# EAGLE design Pyro_Cut-Down (EAGLE 9.1.3)
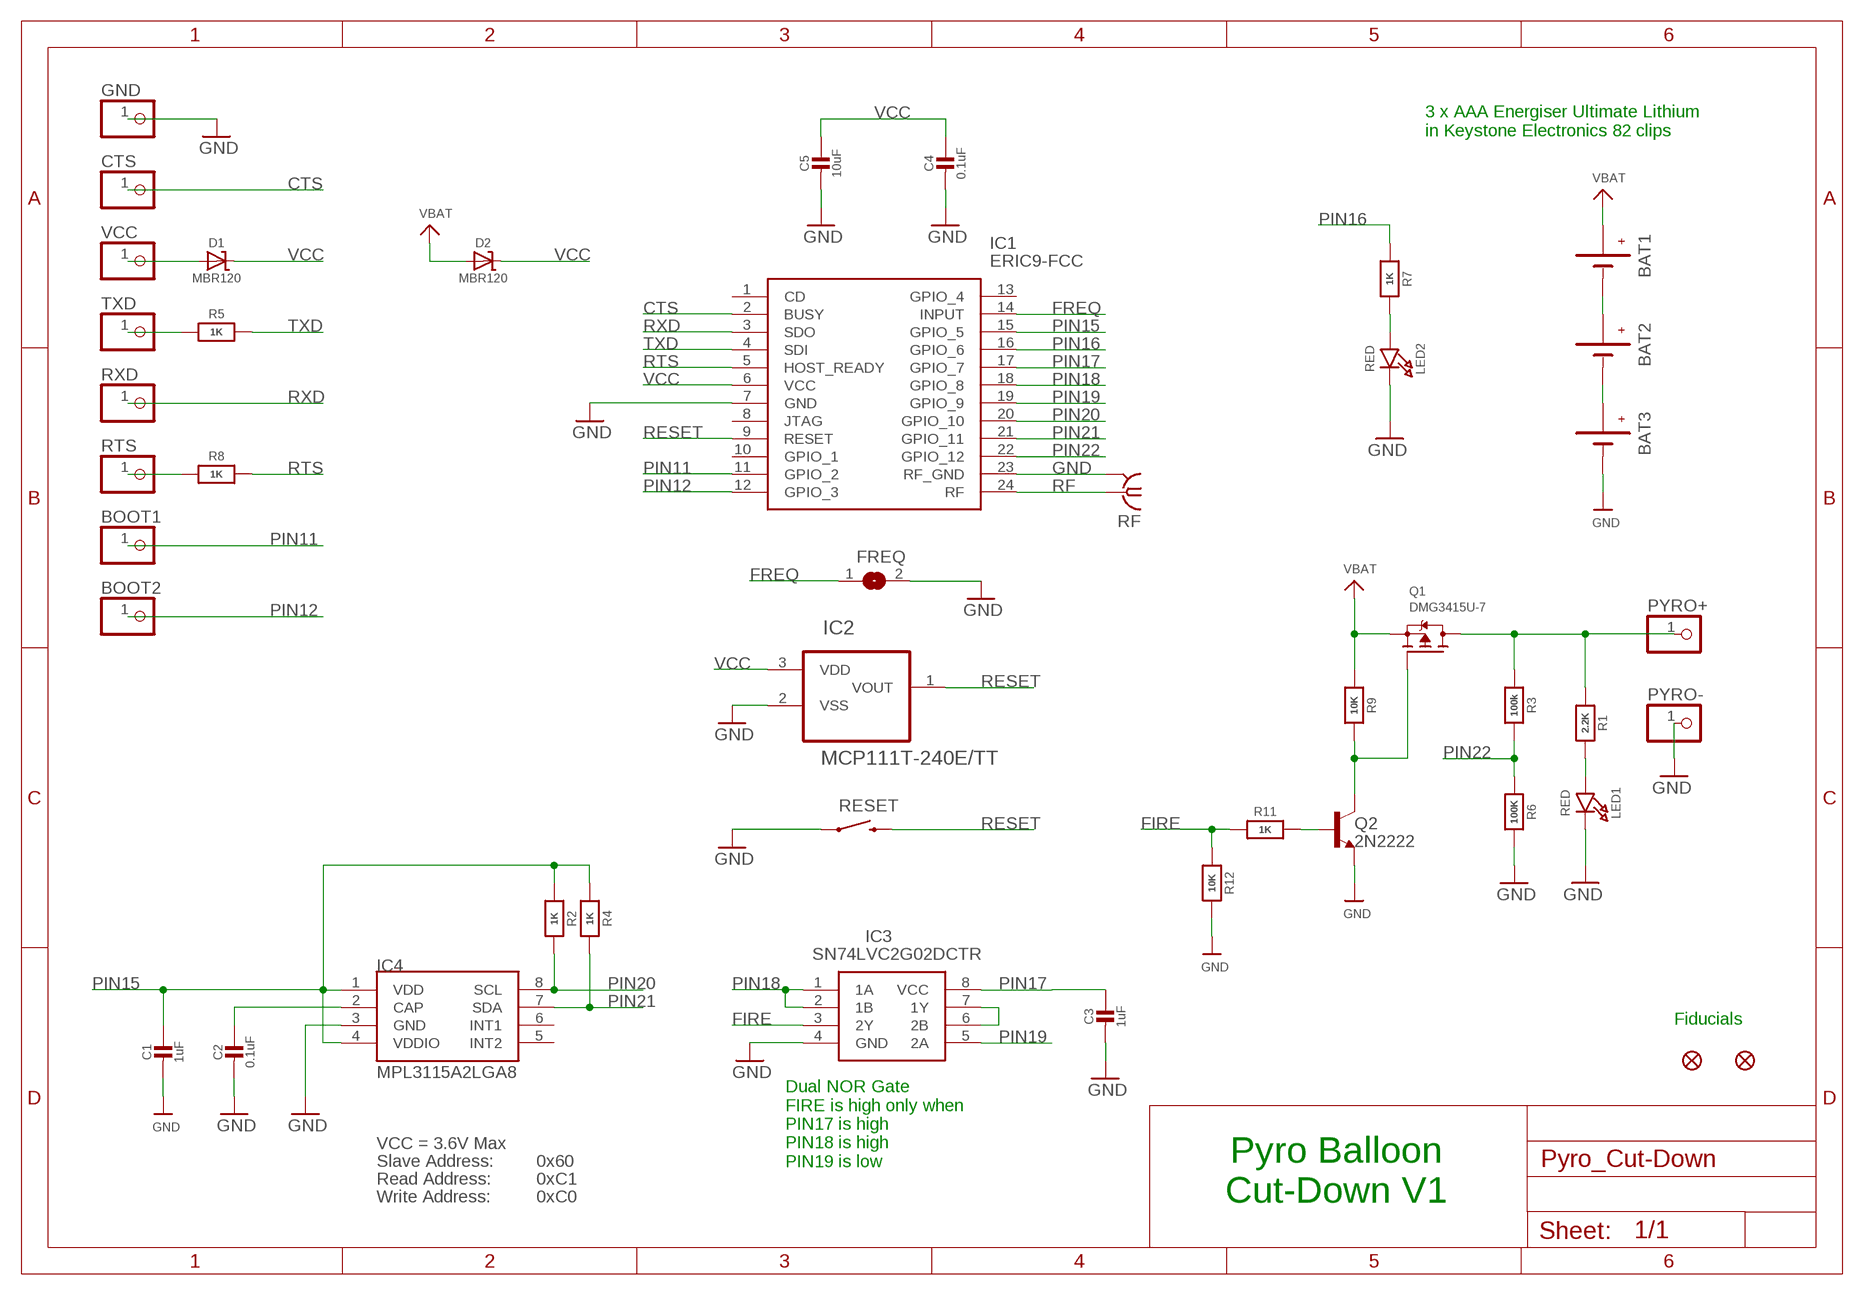
[diagram p0: schematic, sheet 1]

## Parts
BAT1  BATTERYKEYSTONE82  [BATTERY-AAA-KEYSTONE82]
BAT2  BATTERYKEYSTONE82  [BATTERY-AAA-KEYSTONE82]
BAT3  BATTERYKEYSTONE82  [BATTERY-AAA-KEYSTONE82]
BOOT1  PINHD-1X1  [1X01]
BOOT2  PINHD-1X1  [1X01]
C1  1uF  CAP_CERAMIC0603_NO  [0603-NO]
C2  0.1uF  CAP_CERAMIC0603_NO  [0603-NO]
C3  1uF  CAP_CERAMIC0603_NO  [0603-NO]
C4  0.1uF  CAP_CERAMIC0603_NO  [0603-NO]
C5  10uF  CAP_CERAMIC0805-NOOUTLINE  [0805-NO]
CTS  PINHD-1X1  [1X01]
D1  MBR120  DIODE-SCHOTTKYSOD-123  [SOD-123]
D2  MBR120  DIODE-SCHOTTKYSOD-123  [SOD-123]
FD1  FIDUCIAL1X2  [FIDUCIAL-1X2]
FD2  FIDUCIAL1X2  [FIDUCIAL-1X2]
FREQ  SOLDERJUMPER  [SOLDERJUMPER_ARROW_NOPASTE]
GND  PINHD-1X1  [1X01]
IC1  ERIC9-FCC  [ERIC4]
IC2  MCP111T-240E/TT  MCP111T-270E/TT  [SOT95P237X112-3N]
IC3  SN74LVC2G02DCTR  [SOP65P400X130-8N]
IC4  MPL3115A2LGA8  [LGA8]
LED1  RED  LED0805_NOOUTLINE  [CHIPLED_0805_NOOUTLINE]
LED2  RED  LED0805_NOOUTLINE  [CHIPLED_0805_NOOUTLINE]
PYRO+  PINHD-1X1  [1X01]
PYRO-  PINHD-1X1  [1X01]
Q1  DMG3415U-7  MOSFET-PWIDE  [SOT23-WIDE]
Q2  2N2222  MMBT2222ALT1-NPN-SOT23-BEC  [SOT23-BEC]
R1  2.2K  RESISTOR_0603_NOOUT  [0603-NO]
R2  1K  RESISTOR_0603_NOOUT  [0603-NO]
R3  100k  RESISTOR_0603_NOOUT  [0603-NO]
R4  1K  RESISTOR_0603_NOOUT  [0603-NO]
R5  1K  RESISTOR_0603_NOOUT  [0603-NO]
R6  100K  RESISTOR_0603_NOOUT  [0603-NO]
R7  1K  RESISTOR_0603_NOOUT  [0603-NO]
R8  1K  RESISTOR_0603_NOOUT  [0603-NO]
R9  10K  RESISTOR_0603_NOOUT  [0603-NO]
R11  1K  RESISTOR_0603_NOOUT  [0603-NO]
R12  10K  RESISTOR_0603_NOOUT  [0603-NO]
RESET  SWITCH-MOMENTARY-2PTH  [TACTILE-PTH]
RF  SMA-142-0711-821/826  [J502-ND-142-0711-821/826]
RTS  PINHD-1X1  [1X01]
RXD  PINHD-1X1  [1X01]
TXD  PINHD-1X1  [1X01]
VCC  PINHD-1X1  [1X01]

## Nets
CTS: CTS.1 IC1.2(BUSY)
FIRE: IC3.3(2Y) R11.1 R12.1
FREQ: FREQ.1 IC1.14(INPUT)
GND: BAT3.GND@1(-) BAT3.GND@2(-) C1.2 C2.2 C3.2 C4.2 C5.2 FREQ.2 GND.1 IC1.7(GND) IC1.23(RF_GND) IC2.2(VSS) IC3.4(GND) IC4.3(GND) LED1.C LED2.C PYRO-.1 Q2.E R6.2 R12.2 RESET.1 RF.G@1 RF.G@2 RF.G@3 RF.G@4
N$1: BAT2.GND@1(-) BAT2.GND@2(-) BAT3.PWR@1(+) BAT3.PWR@2(+)
N$2: LED2.A R7.2
N$3: BAT1.GND@1(-) BAT1.GND@2(-) BAT2.PWR@1(+) BAT2.PWR@2(+)
N$4: LED1.A R1.2
N$5: R5.1 TXD.1
N$6: IC3.6(2B) IC3.7(1Y)
N$7: R8.1 RTS.1
N$9: D1.A VCC.1
N$19: Q1.1(G) Q2.C R9.2
N$20: Q2.B R11.2
N$25: C2.1 IC4.2(CAP)
PIN11: BOOT1.1 IC1.11(GPIO_2)
PIN12: BOOT2.1 IC1.12(GPIO_3)
PIN15: C1.1 IC1.15(GPIO_5) IC4.1(VDD) IC4.4(VDDIO) R2.1 R4.1
PIN16: IC1.16(GPIO_6) R7.1
PIN17: C3.1 IC1.17(GPIO_7) IC3.8(VCC)
PIN18: IC1.18(GPIO_8) IC3.1(1A) IC3.2(1B)
PIN19: IC1.19(GPIO_9) IC3.5(2A)
PIN20: IC1.20(GPIO_10) IC4.8(SCL) R2.2
PIN21: IC1.21(GPIO_11) IC4.7(SDA) R4.2
PIN22: IC1.22(GPIO_12) R3.2 R6.1
PYRO: PYRO+.1 Q1.3(D) R1.1 R3.1
RESET: IC1.9(RESET) IC2.1(VOUT) RESET.3
RF: IC1.24(RF) RF.1
RTS: IC1.5(HOST_READY) R8.2
RXD: IC1.3(SDO) RXD.1
TXD: IC1.4(SDI) R5.2
VBAT: BAT1.PWR@1(+) BAT1.PWR@2(+) D2.A Q1.2(S) R9.1
VCC: C4.1 C5.1 D1.C D2.C IC1.6(VCC) IC2.3(VDD)
Unconnected: IC1.1(CD) IC1.8(JTAG) IC1.10(GPIO_1) IC1.13(GPIO_4) IC4.5(INT2) IC4.6(INT1)

## Notes on the sheet
- 3 x AAA Energiser Ultimate Lithium
  in Keystone Electronics 82 clips
- Fiducials
- VCC = 3.6V Max
- Slave Address: | 0x60
- Dual NOR Gate
  FIRE is high only when
  PIN17 is high
  PIN18 is high
  PIN19 is low
- Read Address: | 0xC1
- Write Address: | 0xC0
- Pyro Balloon
  Cut-Down V1

## Library data of the parts
BAT1-BAT3 = SparkFun-Electromechanical:BATTERY: Battery Holders Various common sizes : AA, AAA, 18650 (PRT-12895), 20mm coin cell and 12mm coin cell. 20MM_4LEGS, BATT-10373
BOOT1 BOOT2 CTS GND PYRO+ PYRO- RTS RXD TXD VCC = adafruit:PINHD-1X1: Pin header 1x1 for 0.1" spacing With round pins
C1-C5 = microbuilder:CAP_CERAMIC: Ceramic Capacitors For new designs, use the packages preceded by an '_' character since they are more reliable: The following footprints should be used on most boards: _0402 - Standard footprint for regular board layouts _0603 - Standard footprint for regular board layouts _0805 - Standard footprint for regular board layouts _1206 - Standard footprint for regular board layouts For extremely tight-pitch boards where space is at a premium, the following 'micro-pitch' footprints can be used (smaller pads, no silkscreen outline, etc.): _0402MP - Micro-pitch footprint for very dense/compact boards _0603MP - Micro-pitch footprint for very dense/compact boards _0805MP - Micro-pitch footprint for very dense/compact boards _1206MP - Micro-pitch footprint for very dense/compact boards
D1 D2 = microbuilder:DIODE-SCHOTTKY
FD1 FD2 = SparkFun-Aesthetics:FIDUCIAL: Fiducial Alignment Points Various fiducial points for machine vision alignment.
FREQ = microbuilder:SOLDERJUMPER: SMD Solder JUMPER Solder the two pads together to create a connection, or remove the solder to break it. REFLOW - Use this footprint for solder paste and reflow ovens. WAVE - Use this footprint for hand-soldering (larger pads). CLOSED - Has a trace between the two pads to ensure it is closed by default. The trace needs to be cut to disable the jumper, and can be closed again by creating a solder bridge between the two pads.; BOM: EXCLUDE
IC1 = SamacSys_Parts:ERIC9-FCC: RF Modules Euro/US 868/915MHz Int Cont Trans RFMod Source: Datasheet <https://componentsearchengine.com/Datasheets/1/eRIC9-FCC.pdf>; ARROW_PART_NUMBER: eRIC9-FCC; DESCRIPTION: RF Modules Euro/US 868/915MHz Int Cont Trans RFMod; HEIGHT: mm; MANUFACTURER_NAME: LPRS; MANUFACTURER_PART_NUMBER: eRIC9-FCC
IC2 = Microchip-MCP11:MCP11: Micropower Voltage Detector ,SOT23-3;; MPN: MCP111T-240E/TT; OC_FARNELL: 1851877; OC_NEWARK: 56J7328; PACKAGE: SOT23-3; SUPPLIER: MICROCHIP
IC3 = SamacSys_Parts:SN74LVC2G02DCTR: DUAL 2-INPUT POSITIVE-NOR GATE Source: Datasheet <http://www.ti.com/lit/gpn/sn74lvc2g02>; ARROW_PART_NUMBER: SN74LVC2G02DCTR; ARROW_PRICE/STOCK: https://www.arrow.com/en/products/sn74lvc2g02dctr/texas-instruments; DESCRIPTION: DUAL 2-INPUT POSITIVE-NOR GATE; HEIGHT: mm; MANUFACTURER_NAME: Texas Instruments; MANUFACTURER_PART_NUMBER: SN74LVC2G02DCTR
IC4 = SparkFun-Sensors:MPL3115A2: Altimeter/Pressure Sensor, I2C, 1.95V-3.6V supply, 50 to 110kPa
LED1 LED2 = microbuilder:LED: LED 0603 - 0603 Surface Mount Package 2mA: Green LED - Low Power (3.9mcd, 2ma, 1.7Vf) - Digikey: 475-2709-2-ND Orange LED - Low Power (9.8mcd, 2ma, 1.8Vf) - Digikey: 475-1194-2-ND Red LED - Low Power (5mcd, 2ma, 1.8Vf) - Digikey: 475-1195-2-ND Yellow LED - Low Power (7mcd, 2ma, 1.8Vf) - Digikey: 475-1196-2-ND 5mA: Blue LED - Low Power (17mcd, 5ma, 2.9Vf) - Digikey: LNJ937W8CRACT-ND 0805 - 0805 Surface Mount Package 2mA: Red LED (8.8mcd, 2mA, 1.8Vf, Clear) - Low Power [Digikey: 475-2510-1-ND] Green LED (5mcd, 2mA, 1.8Vf, Clear) - Low Power [Digikey: 475-2730-1-ND] Yellow LED (11.3mcd, 2mA, 1.8Vf, Clear) - Low Power [Digikey: 475-2555-1-ND] 20mA: Red LED (104mcd, 20mA, Diffused) - LS R976 [Digikey: 475-1278-6-ND] Red LED (12mcd, 20mA, 2.0Vf, Clear) - APT2012EC [Digikey: 754-1128-1-ND] Green LED (15mcd, 20mA, 2.2Vf, Clear) - APT2012GC [Digikey: 754-1131-1-ND] Orange LED (160mcd, 20mA, 2.1Vf, Clear) - APT2012SECK [Digikey: 754-1130-1-ND] 1206 - 1206 Surface Mount Package Green LED (26mcd, 20mA, Diffused) - LG N971 [Digikey: 475-1407-6-ND] Red LED (15mcd, 20mA, Diffused) - LH N974 [Digikey: 475-1416-6-ND] Cree - Cree High-Power Surface Mount LEDs XPEBWT-L1-0000-00D50 - White 111lm 350mA 2.9Vf 6200K 110° XTEAWT-00-0000-00000LEE3 - White 114lm 350mA 2.85Vf 5000K 115° Everlight - Everlight 45-21 Series Surface Mount LEDs 45-21/QK2C-B2832AC2CB2/2T - Warm White 2000mcd 20mA 3.25Vf 3050K 120° 45-21/LK2C-B38452C4CB2/2T - Nuetral White 2000mcd 20mA 3.25Vf 4150K 120° 45-21/LK2C-B50634C6CB2/2T - Cold White 2200mcd 20mA 3.25Vf 5650K 120° PLCC2 Reverse Mount LS T77K-J1L2-1-0-2-R18-Z - Red 11.25mcd 2mA 1.8Vf 630nm 120° LO T77K-L1M2-24-Z - Orange 19.6mcd 2mA 1.8Vf 606nm 120° LY T77K-K2M1-26-Z - Yellow 15.7mcd 2mA 1.8Vf 587nm 120°
Q1 = microbuilder:MOSFET-P: P-Channel Mosfet LEGEND VDS: Voltage Drain-Source ID: Drain Current RDS(ON): Drain-Source On-State Resistance VGS(TH): Gate-Source Threshold Voltage CISS: Drain-Source Input Capacitance SOT-23 Name VDS ID RDS(ON) VGS(TH) CISS Order Number IRLML5103 30V 760mA 600 mOhm -- 75pF @ 25V Digikey: IRLML5103PBFCT-ND IRLML6401 12V 4.3A 50 mOhm 950mV @ 250µA 830pF @ 10V Digikey: IRLML6401PBFTR-ND NTR0202PL 20V 400mA 800 mOhm 2.3V @ 250uA 70pF @ 5V Digikey: NTR0202PLT1GOSTR-ND NTR4101PT1G 20V 1.8A 85 mOhm 1.2V @ 250uA 675pF @ 10V Digikey: NTR4101PT1GOSCT-ND DMP2004K 20V 600mA 900 mOhm 1V @ 250uA 175pF @ 16V Digikey: DMP2004KDICT-ND PMV65XP 20V 3.9A 76 mOhm 950mV @ 1mA 725pF @ 20V Digikey: 568-2358-2-ND TO-252 Name VDS ID RDS(ON) VGS(TH) CISS Order Number AOD417 30V 25A 34 mOhm 3V @ 250µA 920pF @ 15V Digikey: 785-1106-2-ND
Q2 = transistor:*-NPN-: NPN Transistror BF959 corrected 2008.03.06
R1-R9 R11 R12 = microbuilder:RESISTOR: Resistors For new designs, use the packages preceded by an '_' character since they are more reliable: The following footprints should be used on most boards: _0402 - Standard footprint for regular board layouts _0603 - Standard footprint for regular board layouts _0805 - Standard footprint for regular board layouts _1206 - Standard footprint for regular board layouts For extremely tight-pitch boards where space is at a premium, the following 'micro-pitch' footprints can be used (smaller pads, no silkscreen outline, etc.): _0402MP - Micro-pitch footprint for very dense/compact boards _0603MP - Micro-pitch footprint for very dense/compact boards _0805MP - Micro-pitch footprint for very dense/compact boards _1206MP - Micro-pitch footprint for very dense/compact boards
RESET = SparkFun-Electromechanical:SWITCH-MOMENTARY-2: Various NO switches- pushbuttons, reed, etc; PROD_ID: SWCH-08441
RF = con-coax:SMA-: SMA 50 Ohm End Launch Jack Receptacle - Round Contact Johnson Components Source: www.johnsoncomponents.com .. J502-ND.pdf; MF: JOHNSON COMPONENTS; MPN: 142-0711-821; OC_FARNELL: 1019328; OC_NEWARK: 16F3627

## Board
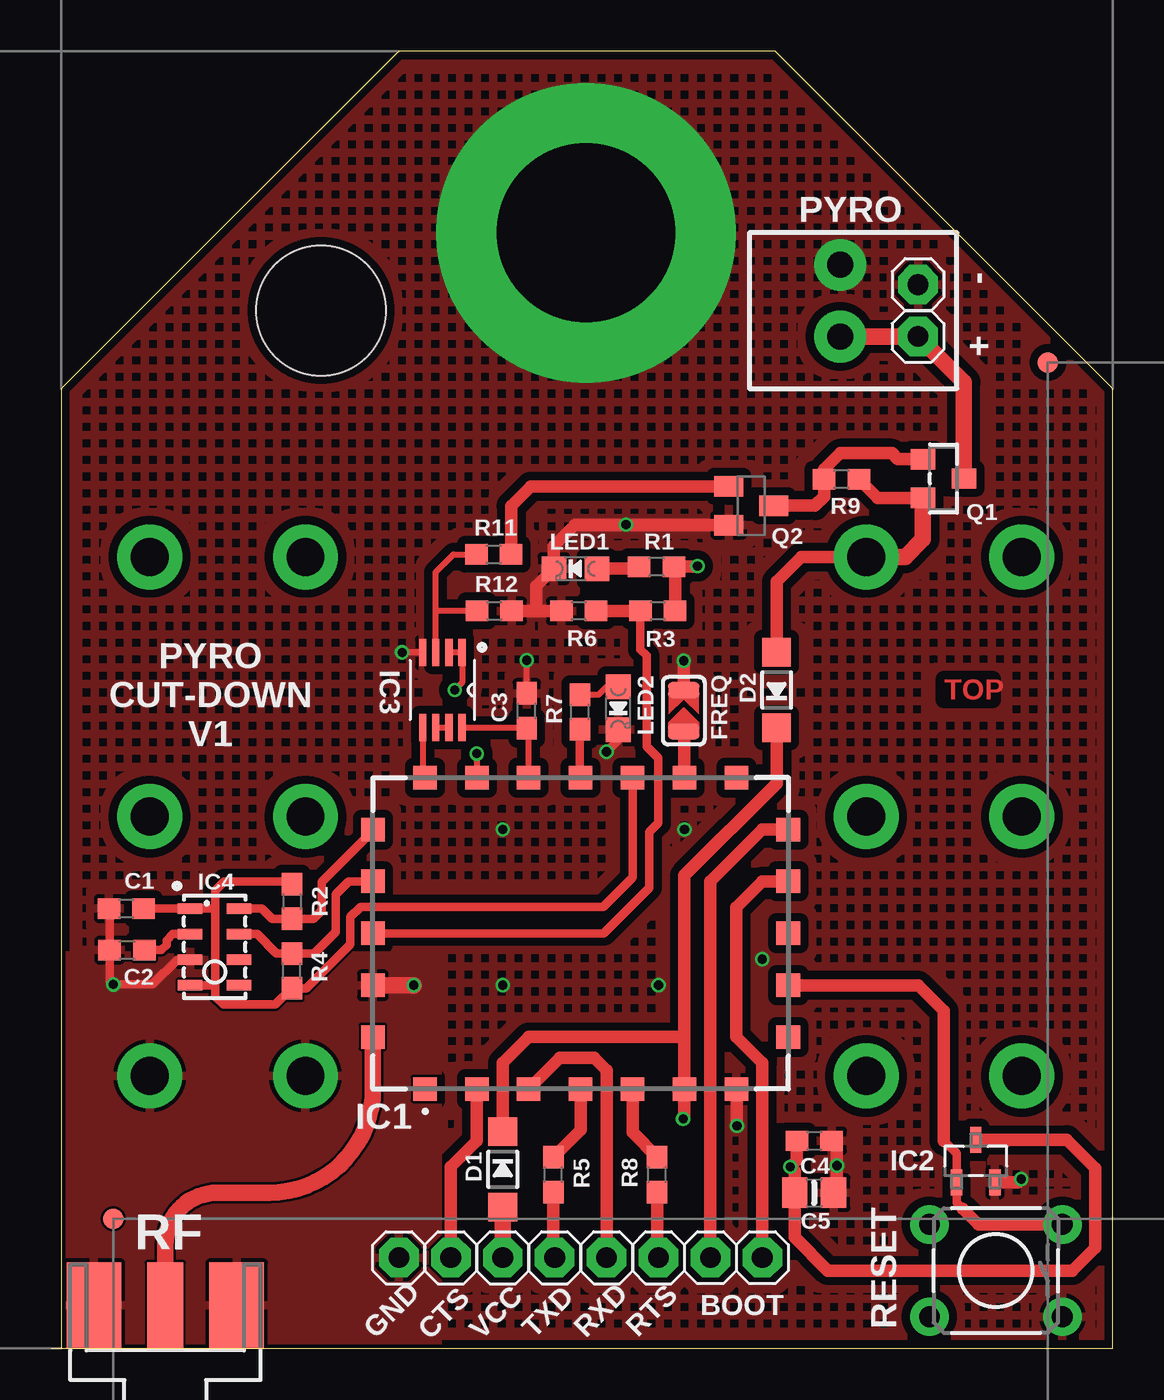
[diagram p1: board, top side]
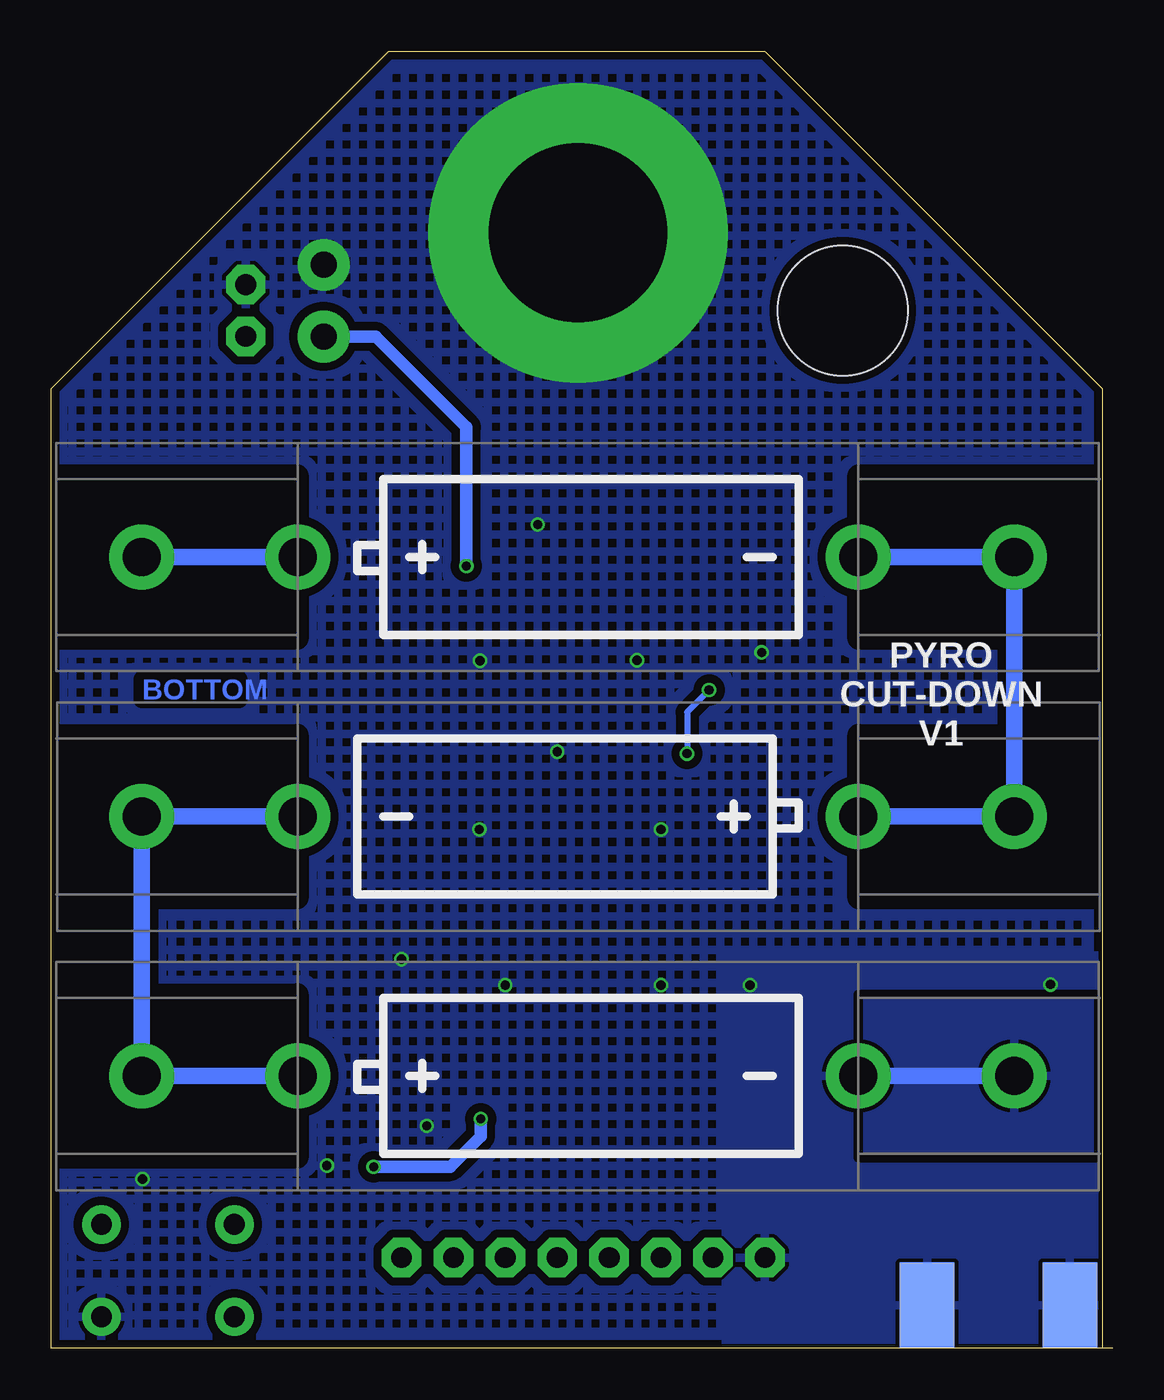
[diagram p2: board, bottom side, seen from below]

Size 51.44 x 63.5 mm. Coordinates in mm from the lower left corner, seen from the top.
Outline: 0,0 5.52,0 8.89,0 13.97,0 17.78,0 51.44,0 51.44,46.99 34.92,63.5 16.51,63.5 0,46.99 0,0
Copper layers (1*16): Top 0.018mm / dielectric 1.55mm / Bottom 0.018mm
Design rules "Multi-CB_2L_125um-Tracks_OL35um": minimum track width 0.125mm, minimum drill 0.2mm, track to track 0.125mm, track to pad 0.125mm, pad to pad 0.125mm, via to via 0.125mm, smd to smd 0mil, copper to edge 0.2mm, drill to drill 0.2mm, minimum pad ring 0.125mm, minimum via ring 0.125mm, stop-mask expansion 2mil, vias tented up to drill 0.45mm, thermal gap 0.2mm
Holes 6.35 mm at 12.7,50.8

### Footprints (pad centres in the part's own frame; a part is rotated, then mirrored left to right if it is on the bottom)
BATTERY-AAA-KEYSTONE82 = drill 1.854 pad 3.175: GND@1 21.336,0; GND@2 13.716,0; PWR@1 -21.336,0; PWR@2 -13.716,0
1X01 = drill 1.016 pad 1.93 octagon: 1 0,0
0603-NO = smd 1.1 x 1: 1 -0.85,0; 2 0.85,0
0805-NO = smd 1.24 x 1.5: 1 -0.95,0; 2 0.95,0
SOD-123 = smd 1.4 x 1.4: A 1.85,0; C -1.85,0
FIDUCIAL-1X2 = smd 1 x 1: 1 0,0
SOLDERJUMPER_ARROW_NOPASTE = smd 0.762 x 1.524: 1 -1.016,0; 2 1.016,0
ERIC4 = smd 1.15 x 1.15: 1 -7.62,-7.62; 2 -5.08,-7.62; 3 -2.54,-7.62; 4 0,-7.62; 5 2.54,-7.62; 6 5.08,-7.62; 7 7.62,-7.62; 8 10.16,-5.08; 9 10.16,-2.54; 10 10.16,0; 11 10.16,2.54; 12 10.16,5.08; 13 7.62,7.62; 14 5.08,7.62; 15 2.54,7.62; 16 0,7.62; 17 -2.54,7.62; 18 -5.08,7.62; 19 -7.62,7.62; 20 -10.16,5.08; 21 -10.16,2.54; 22 -10.16,0; 23 -10.16,-2.54; 24 -10.16,-5.08
SOT95P237X112-3N = smd 0.559 x 1.27: 1 -0.94,-1.041; 2 0.94,-1.041; 3 0,1.041
SOP65P400X130-8N = smd 1.321 x 0.356: 1 -1.829,0.965; 2 -1.829,0.33; 3 -1.829,-0.33; 4 -1.829,-0.965; 5 1.829,-0.965; 6 1.829,-0.33; 7 1.829,0.33; 8 1.829,0.965
LGA8 = smd 1.2 x 0.5: 1 -1.2,1.875; 2 -1.2,0.625; 3 -1.2,-0.625; 4 -1.2,-1.875; 5 1.2,-1.875; 6 1.2,-0.625; 7 1.2,0.625; 8 1.2,1.875
CHIPLED_0805_NOOUTLINE = smd 1.2 x 1.2: A 0,-1.05; C 0,1.05
SOT23-WIDE = smd 1 x 1.2: 1 -0.95,-1; 2 0.95,-1; 3 0,1
SOT23-BEC = smd 1 x 1.4: B -0.95,-1.1; C 0,1.1; E 0.95,-1.1
TACTILE-PTH = drill 1.016 pad 1.88: 1 -3.251,2.261; 2 3.251,2.261; 3 -3.251,-2.261; 4 3.251,-2.261
J502-ND-142-0711-821/826 = smd 4.191 x 1.778: 1 2.115,0 | smd 4.191 x 2.667: G@1 2.115,3.495; G@2 2.115,-3.495 | smd 4.191 x 2.667 bottom: G@3 2.115,3.495; G@4 2.115,-3.495

### Placement (x,y rotation side)
BAT1  25.65,38.73 0 bottom
BAT2  25.65,26.04 180 bottom
BAT3  25.65,13.34 0 bottom
BOOT1  34.29,4.45 0 top
BOOT2  31.75,4.45 0 top
C1  3.17,21.53 180 top
C2  3.21,19.49 180 top
C3  22.76,31.21 90 top
C4  36.83,10.16 0 top
C5  36.83,7.62 0 top
CTS  19.05,4.45 90 top
D1  21.59,8.76 270 top
D2  34.99,32.23 90 top
FD1  48.26,48.26 0 top
FD2  2.54,6.35 0 top
FREQ  30.45,31.21 90 top
GND  16.51,4.45 90 top
IC1  25.4,20.32 0 top
IC2  44.74,9.18 0 top
IC3  18.64,32.23 270 top
IC4  7.49,19.65 0 top
LED1  25.15,38.16 90 top
LED2  27.24,31.34 180 top
PYRO+  41.91,49.53 0 top
PYRO-  41.91,52.07 0 top
Q1  43.15,42.58 270 top
Q2  33.75,41.24 270 top
R1  29.11,38.26 180 top
R2  11.27,21.88 270 top
R3  29.18,36.1 180 top
R4  11.27,18.48 90 top
R5  24.07,8.51 90 top
R6  25.3,36.1 180 top
R7  25.37,31.15 90 top
R8  29.15,8.51 90 top
R9  38.16,42.55 180 top
R11  21.15,38.86 0 top
R12  21.18,36.1 0 top
RESET  45.72,3.81 180 top
RF  5.08,0 90 top
RTS  29.21,4.45 90 top
RXD  26.67,4.45 90 top
TXD  24.13,4.45 90 top
VCC  21.59,4.45 90 top

### Tracks (layer width: path | path; a pad name or v marks a point on that pad's centre or on a via)
CTS
  Top 0.61: CTS.1 19.05,8.89 20.32,10.16 IC1.2
FIRE
  Top 0.305: IC3.3 18.31,36.07 | 18.31,36.07 18.31,37.99 19.18,38.86 R11.1 | R12.1 18.34,36.1 18.31,36.07
FREQ
  Top 0.61: IC1.14 30.48,30.16 FREQ.1
GND  (via drill 0.45, 1.27 pad 2.54, 8.74 pad 14.66)
  Top 0.305: IC3.4 16.68,34.05 v16.67,34.07 | C3.2 v22.77,33.69
  Top 0.406: C1.2 2.36,21.5 C2.2 2.36,18 v2.54,17.81 4.45,17.81 5.66,19.03 IC4.3 | LED2.C 27.24,29.78 v26.67,29.21
  Top 0.61: IC1.7 33.05,12.67 v33.05,10.89 | IC2.2 46.81,8.13 v46.96,8.29 | C4.2 37.94,9.9 v37.94,8.95 37.94,7.78 C5.2 | FREQ.2 v30.45,33.66 | Q2.E 27.65,40.29 | 27.65,40.29 v27.62,40.32 | R12.2 23.24,36.1 | 23.24,36.1 R6.2 | 23.24,36.1 23.24,37.31 LED1.C 24.1,39.27 25.12,40.29 27.65,40.29
  Top 0.813: IC1.23 v17.24,17.78
  Bottom 0.813: BAT3.GND@2 BAT3.GND@1
  other vias: 25.65,54.61 38.1,53.04 21.59,25.4 30.48,25.4 21.59,17.78 29.21,17.78 34.29,19.05
  pour Bottom (isolate 0.406, rank 2, hatched): 0,0 0,45.72 0,46.99 16.51,63.5 34.92,63.5 51.44,46.99 51.44,0
  pour Top (isolate 0.406, rank 2, hatched): 0,0 0,45.72 0,46.99 16.51,63.5 34.92,63.5 51.44,46.99 51.44,0
  pour Top (isolate 0.102): 0,0 0,19.24 18.41,19.24 18.41,0
  pour Bottom (isolate 0.102): 0,0 0,19.24 18.41,19.24 18.41,0
N$1
  Bottom 0.813: BAT3.PWR@2 BAT3.PWR@1 BAT2.GND@1 BAT2.GND@2
N$2
  Top 0.305: R7.2 26.28,32 26.67,32.39 LED2.A
N$3
  Bottom 0.813: BAT2.PWR@2 BAT2.PWR@1 BAT1.GND@1 BAT1.GND@2
N$4
  Top 0.61: LED1.A 28.17,38.16 R1.2
N$5
  Top 0.61: TXD.1 24.07,4.51 R5.1
N$6
  Top 0.305: IC3.6 IC3.7
N$7
  Top 0.61: RTS.1 29.15,4.51 R8.1
N$9
  Top 0.813: VCC.1 D1.A
N$19
  Top 0.61: Q1.1 40.93,43.53 40.64,43.81 38.1,43.81 37.31,43.03 R9.2 37.31,41.7 36.86,41.24 Q2.C
N$20
  Top 0.61: Q2.B 22.95,42.19 22,41.24 R11.2
N$25
  Top 0.406: IC4.2 5.45,20.28 5.14,19.97 5.14,19.75 4.89,19.49 C2.1
PIN11
  Top 0.61: BOOT1.1 34.29,13.97 33.02,15.24 33.02,21.59 34.29,22.86 IC1.11
PIN12
  Top 0.61: BOOT2.1 31.75,22.86 34.29,25.4 IC1.12
PIN15
  Top 0.406: C1.1 IC4.1 7.53,21.53 | 7.53,17.78 IC4.4 | 7.53,21.53 7.53,17.78 | 7.53,17.78 7.53,17.21 7.91,16.83 10.47,16.83 R4.1 11.98,17.63 14.13,19.78 14.13,21.11 14.64,21.62 26.51,21.62 27.94,23.05 IC1.15 | R2.1 11.14,22.86 7.97,22.86 7.53,22.42 7.53,21.53
PIN16
  Top 0.406: IC1.16 25.37,27.97 R7.1
PIN17
  Top 0.305: IC3.8 22.73,30.4 | 22.73,30.4 C3.1 | IC1.17 22.86,30.27 22.73,30.4
PIN18  (via drill 0.45)
  Top 0.305: IC3.2 IC3.1 19.6,32.59 v19.24,32.23 | v20.32,29.11 IC1.18
  Bottom 0.305: v19.24,32.23 20.32,31.15 v20.32,29.11
PIN19
  Top 0.305: IC3.5 17.67,28.05 IC1.19
PIN20
  Top 0.406: IC4.8 9.81,21.53 10.31,21.03 R2.2 12.33,21.03 12.73,21.43 12.73,22.83 15.24,25.34 IC1.20
PIN21
  Top 0.406: IC4.7 9.57,20.28 10.52,19.33 R4.2 12.38,19.33 13.43,20.38 13.43,22.23 14.06,22.86 IC1.21
PIN22
  Top 0.406: R3.2 28.33,34.22 28.64,33.91 28.64,29.46 29.21,28.89 29.21,25.72 28.77,25.27 28.77,22.54 26.54,20.32 IC1.22
  Top 0.61: R6.1 26.67,36.1 R3.2
PYRO  (via drill 0.45, 1.27 pad 2.54)
  Top 0.61: R3.1 30.03,36.83 30.03,38.2 R1.1 31.08,38.26 v31.11,38.29
  Top 0.813: Q1.3 44.15,47.29 PYRO+.1 v38.1,49.53
  Bottom 0.61: v31.11,38.29 31.11,45.09 35.56,49.53 v38.1,49.53
RESET
  Top 0.406: 43.18,10.16 43.8,9.54 IC2.1 43.8,7.13 44.1,6.83
  Top 0.61: IC1.9 41.91,17.78 43.18,16.51 43.18,10.16 | 44.1,6.83 44.86,6.07 RESET.3
RF
  Top 0.813: IC1.24 15.24,12.7 arc-90 10.16,7.62 7.62,7.62 arc90 5.08,5.08 RF.1
RTS
  Top 0.61: R8.2 27.94,10.57 IC1.5
RXD
  Top 0.61: IC1.3 24.38,14.22 26.07,14.22 26.67,13.62 RXD.1
TXD
  Top 0.61: R5.2 25.4,10.69 IC1.4
VBAT
  Top 0.61: D2.A 34.99,37.53 36.2,38.73 BAT1.PWR@2 | R9.1 39.93,41.63 Q1.2
  Top 0.813: Q1.2 42.15,39.61 41.27,38.73 BAT1.PWR@2
  Bottom 0.813: BAT1.PWR@2 BAT1.PWR@1
VCC  (via drill 0.45)
  Top 0.61: D1.C 21.59,13.97 22.86,15.24 30.45,15.24 30.48,15.27 | IC2.3 49.19,10.22 50.58,8.83 50.58,4.92 49.47,3.81 37.5,3.81 35.88,5.43 C5.1 35.88,8.66 v35.66,8.89 35.98,9.21 C4.1 | v30.42,11.24 30.48,11.3 IC1.6 30.48,15.27 | D2.C 34.99,27.65 30.48,23.15 30.48,15.27
  Bottom 0.61: v35.66,8.89 31.91,8.89 30.42,10.38 v30.42,11.24

### Text on the board
Top: TOP
Bottom: BOTTOM
tPlace: PYRO | - | + | PYRO / CUT-DOWN / V1 | BOOT
bPlace: PYRO / CUT-DOWN / V1